# EasyEDA Pro project Board1.eprj

# Schematic Schematic1
Create Date: 2023-07-02; Page Name: P1; Project Name: STM32F407; Schematic Name: Schematic1; Update Date: 2023-07-29; Company: 嘉立创EDA; Page Size: A4; Version: V1.0
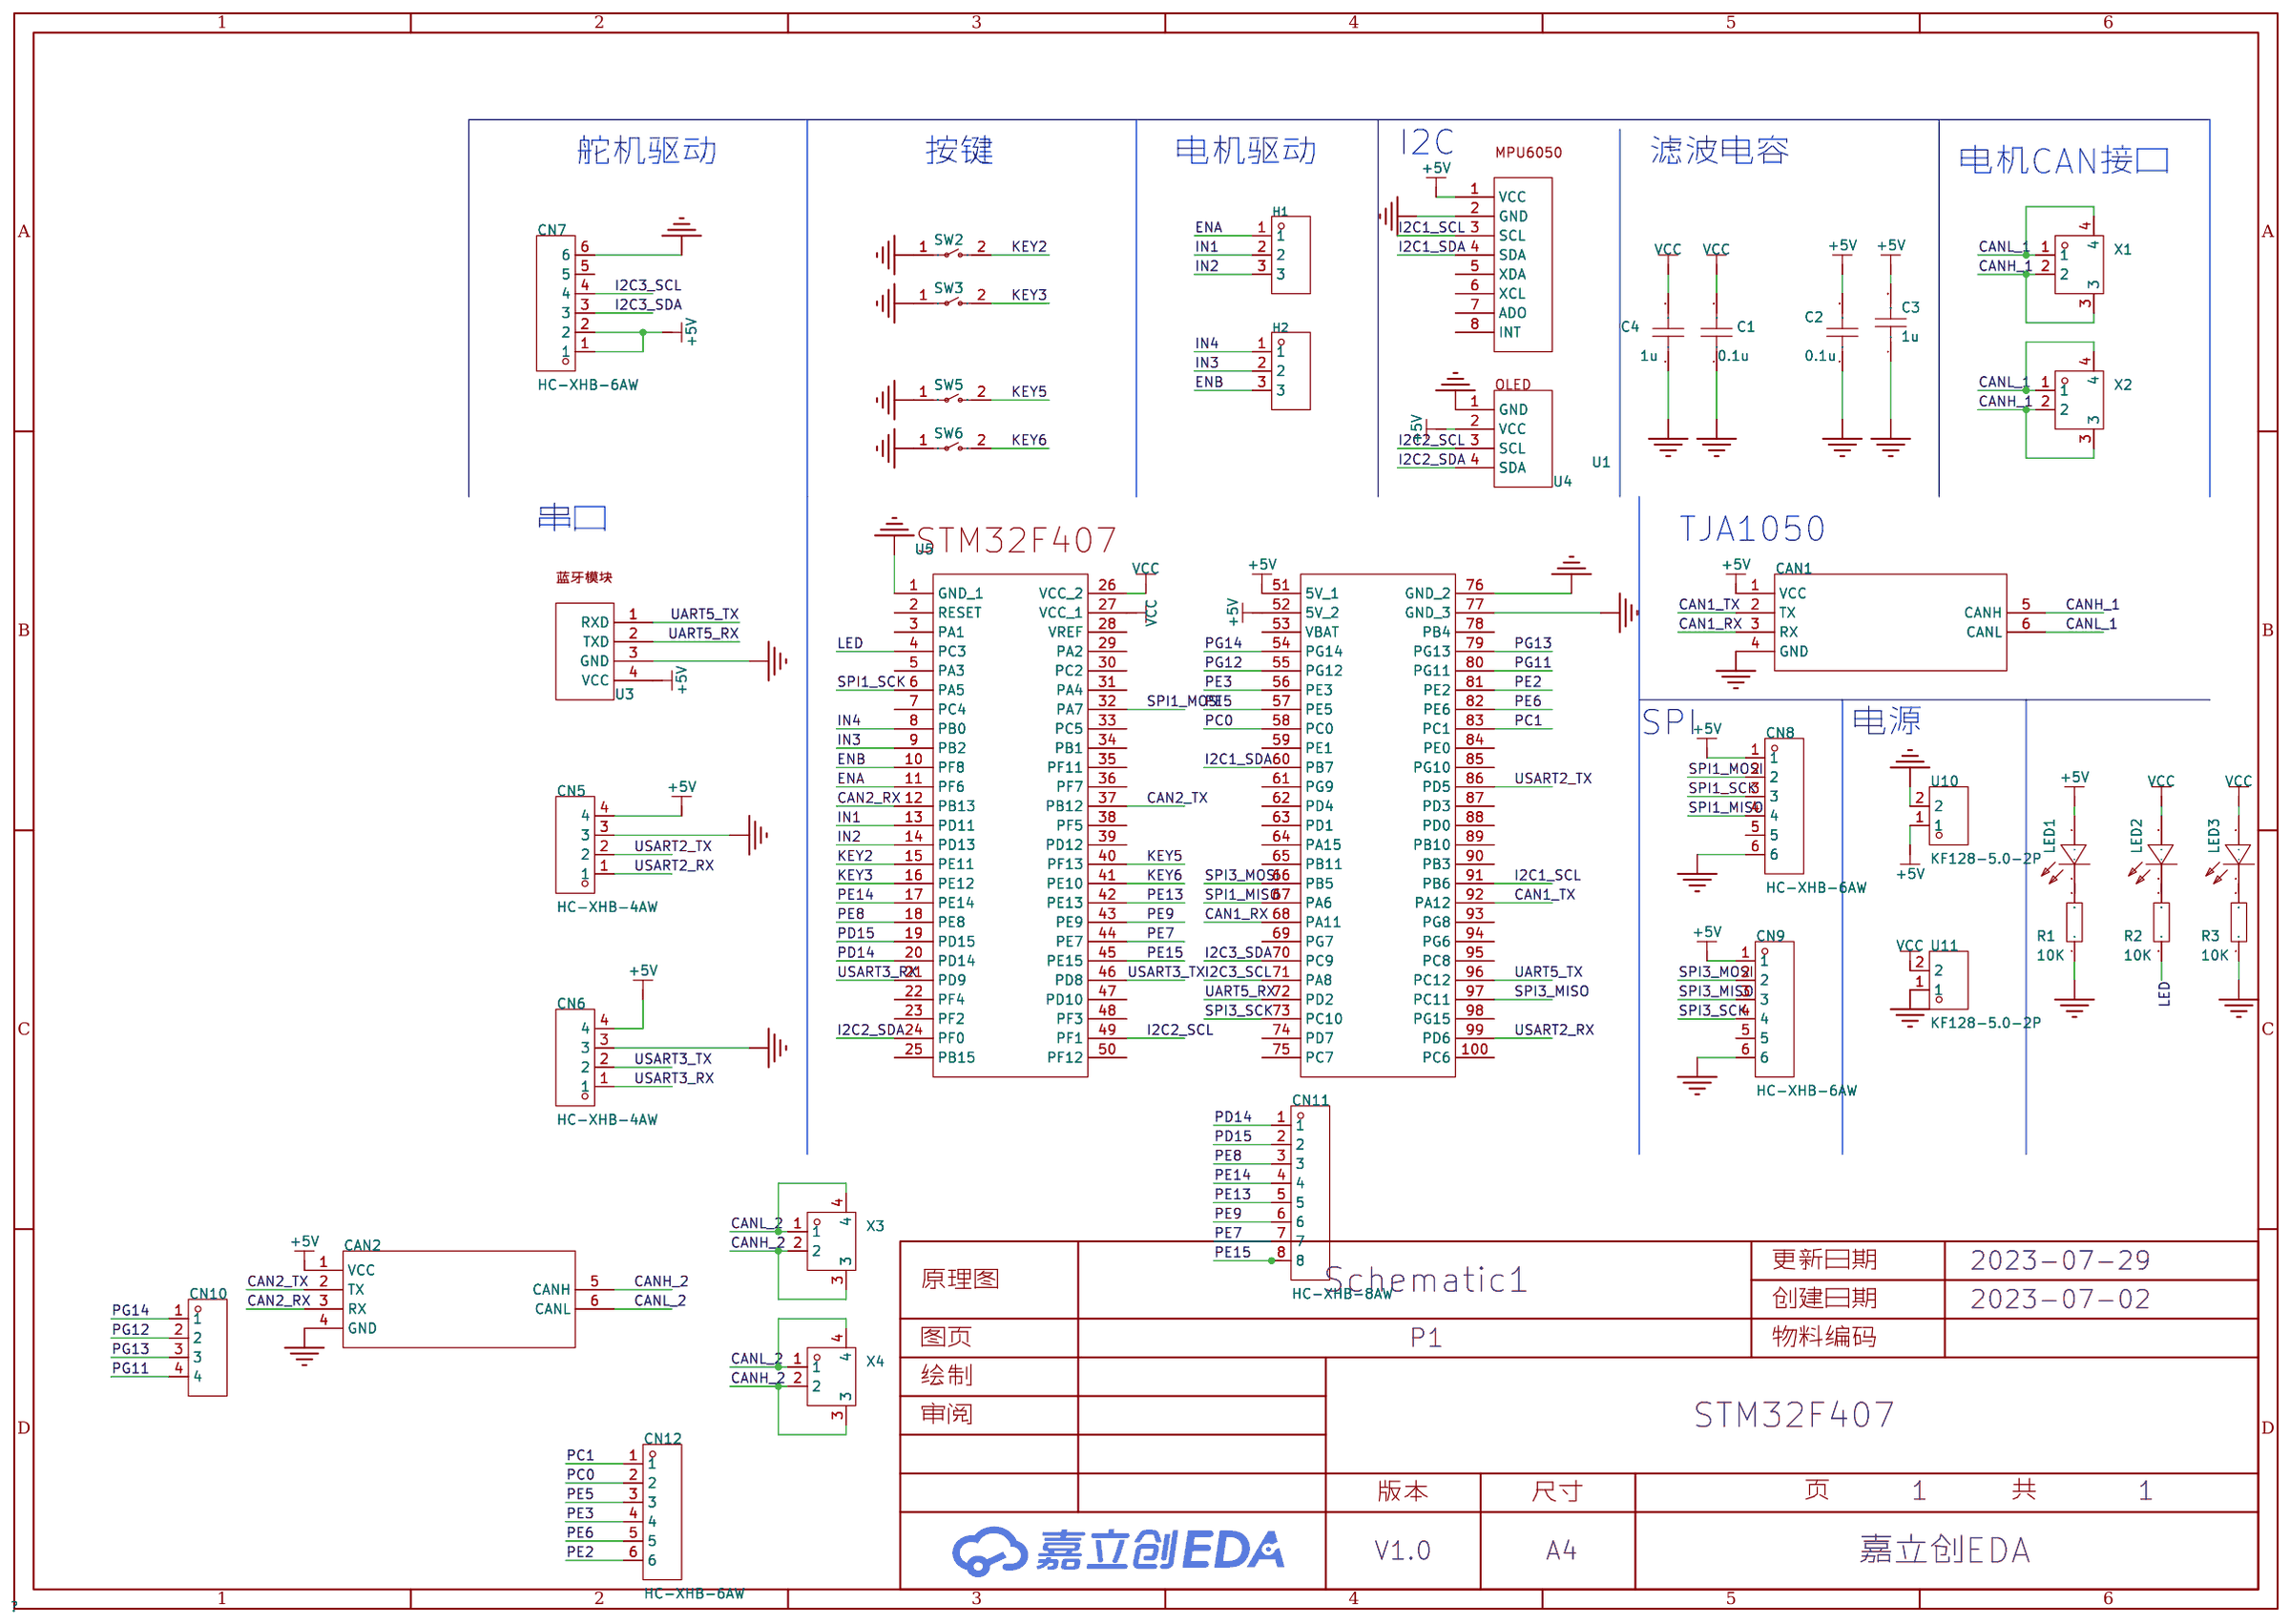
[diagram p0: schematic sheet]

## Parts
C1  0.1u  [C0603]
C2  0.1u  [C0603]
C3  1u  [C0603]
C4  1u  [C0603]
CAN1  -  [CAN模块]
CAN2  -  [CAN模块]
CN5  HC-XHB-4AW  [CONN-TH_4P-P2.5_HCTL_HC-XHB-4AW]
CN6  HC-XHB-4AW  [CONN-TH_4P-P2.5_HCTL_HC-XHB-4AW]
CN7  HC-XHB-6AW  [CONN-TH_6P-P2.50_HCTL_HC-XHB-6AW]
CN8  HC-XHB-6AW  [CONN-TH_6P-P2.50_HCTL_HC-XHB-6AW]
CN9  HC-XHB-6AW  [CONN-TH_6P-P2.50_HCTL_HC-XHB-6AW]
CN10  HC-XHB-4AW  [CONN-TH_4P-P2.5_HCTL_HC-XHB-4AW]
CN11  HC-XHB-8AW  [CONN-TH_HC-XHB-8AW]
CN12  HC-XHB-6AW  [CONN-TH_6P-P2.50_HCTL_HC-XHB-6AW]
H1  -  [HDR-TH_3P-P2.54-V-F]
H2  -  [HDR-TH_3P-P2.54-V-F]
LED1  NCD0805R1  [LED0805-RD_RED]
LED2  NCD0805R1  [LED0805-RD_RED]
LED3  NCD0805R1  [LED0805-RD_RED]
R1  10K  [R0603]
R2  10K  [R0603]
R3  10K  [R0603]
SW2  TS-1007S-AR02516  [SW-SMD_L6.1-W3.6-LS7.9]
SW3  TS-1007S-AR02516  [SW-SMD_L6.1-W3.6-LS7.9]
SW5  TS-1007S-AR02516  [SW-SMD_L6.1-W3.6-LS7.9]
SW6  TS-1007S-AR02516  [SW-SMD_L6.1-W3.6-LS7.9]
U1  -  [MPU6050]
U3  -  [蓝牙模块]
U4  -  [OLED]
U5  -  [CORE BORED]  (section 1)
U10  KF128-5.0-2P  [CONN-TH_P5.00_KF128-5.0-2P]
U11  KF128-5.0-2P  [CONN-TH_P5.00_KF128-5.0-2P]
X1  GH125-S02DCA-00  [CONN-SMD_2P-P1.25_JUSHUO_GH125-S02DCA-00]
X2  GH125-S02DCA-00  [CONN-SMD_2P-P1.25_JUSHUO_GH125-S02DCA-00]
X3  GH125-S02DCA-00  [CONN-SMD_2P-P1.25_JUSHUO_GH125-S02DCA-00]
X4  GH125-S02DCA-00  [CONN-SMD_2P-P1.25_JUSHUO_GH125-S02DCA-00]

## Library data of the parts
C1-C4 = CAP_0603: Supplier Footprint: 0603
CAN1 CAN2 = CAN模块
CN5 CN6 CN10 = HC-XHB-4AW: 参考系列:-;间距:2.5mm;插针结构:1x4P;排数:1;每排PIN数:4;行距:-;公母:公型插针;安装方式:弯插;额定电流:3A;工作温度范围:-25℃~+85℃;; LCSC Part Name: 2.54带锁扣卧式插件 4P 针座连接器线对板/线对线连接器; Supplier Part: C2845507; Manufacturer: HCTL(华灿天禄); Supplier Footprint: 弯插,P=2.5mm; JLCPCB Part Class: Extended Part; Datasheet: https://atta.szlcsc.com/upload/public/pdf/source/20210729/C2845505_EFBF7AEAA36C6A5A1E79F7933436620E.pdf; Supplier: LCSC; Pitch: 2.5mm; Pins Structure: 1x4P; Number of Rows: 1; Number of PINs Per Row: 4; Gender: 公型插针; Mounting Style: 弯插; Current Rating (Max): 3A; Operating Temperature Range: -25℃~+85℃
CN7-CN9 CN12 = HC-XHB-6AW: 参考系列:-;间距:2.5mm;插针结构:1x6P;排数:1;每排PIN数:6;行距:-;公母:公型插针;安装方式:弯插;额定电流:3A;工作温度范围:-25℃~+85℃;; LCSC Part Name: 2.54带锁扣卧式插件 6P 针座连接器线对板/线对线连接器; Supplier Part: C2845509; Manufacturer: HCTL(华灿天禄); Supplier Footprint: 弯插,P=2.5mm; JLCPCB Part Class: Extended Part; Datasheet: https://atta.szlcsc.com/upload/public/pdf/source/20210729/C2845505_EFBF7AEAA36C6A5A1E79F7933436620E.pdf; Supplier: LCSC; Pitch: 2.5mm; Pins Structure: 1x6P; Number of Rows: 1; Number of PINs Per Row: 6; Gender: 公型插针; Mounting Style: 弯插; Current Rating (Max): 3A; Operating Temperature Range: -25℃~+85℃
CN11 = HC-XHB-8AW: 参考系列:-;间距:2.5mm;插针结构:1x8P;排数:1;每排PIN数:8;行距:-;公母:公型插针;安装方式:弯插;额定电流:3A;工作温度范围:-25℃~+85℃;; LCSC Part Name: 2.54带锁扣卧式插件 8P 针座连接器线对板/线对线连接器; Supplier Part: C2845511; Manufacturer: HCTL(华灿天禄); Supplier Footprint: 弯插,P=2.5mm; JLCPCB Part Class: Extended Part; Datasheet: https://atta.szlcsc.com/upload/public/pdf/source/20210729/C2845505_EFBF7AEAA36C6A5A1E79F7933436620E.pdf; Supplier: LCSC; Pitch: 2.5mm; Pins Structure: 1x8P; Number of Rows: 1; Number of PINs Per Row: 8; Gender: 公型插针; Mounting Style: 弯插; Current Rating (Max): 3A; Operating Temperature Range: -25℃~+85℃
H1 H2 = HDR-F_2.54_1x3P: Supplier Part: C541850; Supplier Footprint: 插件
LED1-LED3 = NCD0805R1: 发光颜色:红灯;; LCSC Part Name: 红灯; Supplier Part: C84256; Manufacturer: 国星光电; Supplier Footprint: 0805; JLCPCB Part Class: Basic Part; Datasheet: https://atta.szlcsc.com/upload/public/pdf/source/20200820/C84256_F0A75A43B3EAD75808600A0514C76B99.pdf; Supplier: LCSC; Emitted Color: 红灯
R1-R3 = Res_0603: Supplier Footprint: 0603
SW2 SW3 SW5 SW6 = TS-1007S-AR02516: 触点电流:50mA;额定电压(DC):12V;绝缘电阻:100MΩ;电路结构:单刀单掷;安装方式:立贴;作用力:160gf@±50gf;机械寿命:5万次;带支架:否;; LCSC Part Name: 6.1*3.7*2.5mm 立贴 轻触开关; Supplier Part: C720381; Manufacturer: XUNPU(讯普); Supplier Footprint: SMD; JLCPCB Part Class: Extended Part; Datasheet: https://atta.szlcsc.com/upload/public/pdf/source/20200812/C720381_7D5C1A68D18F0196EF37FF8AC1146778.pdf; Supplier: LCSC; Contact Current: 50mA; Voltage Rating (DC): 12V; Insulation Resistance: 100MΩ; Circuit: 单刀单掷; Mounting Style: 立贴; Actuator Style: 矩形按钮; Actuator/Cap Color: 灰色; Operating Force: 160gf@±50gf; Mechanical Life: 5万次; Operating Temperature: -30℃~+80℃; Pin Style: 鸥翼型; Switch Length: 6.1mm; Switch Width: 3.7mm; Switch Height: 2.5mm; Strike Gundam: 否
U1 = MPU6050
U3 = 蓝牙模块
U4 = OLED
U5 = CORE BORED
U10 U11 = KF128-5.0-2P: 间距:5mm;排数:1;每排PIN数:2;安装方式:直针;额定电流:24A;额定电压:250V;线规 - AWG:12~22;线规 - mm?:2.5;工作温度范围:-40℃~+105℃;颜色:绿色;; LCSC Part Name: 5mm 排数:1 每排P数:2 直针 可拼接 铜 环保; Supplier Part: C474950; Manufacturer: KEFA(科发); Supplier Footprint: 直插,P=5mm; JLCPCB Part Class: Extended Part; Datasheet: https://atta.szlcsc.com/upload/public/pdf/source/20200115/C474950_DBD958BD409DEFD076718528A2A5023E.pdf; Supplier: LCSC; Pitch: 5mm; Number of Rows: 1; Number of PINs Per Row: 2; Mounting Style: 直针; Current Rating (Max): 24A; Voltage Rating (Max): 250V; Wire Gauge - AWG: 12~22; Wire Gauge - mm?: 2.5; Operating Temperature Range: -40℃~+105℃; Color: 绿色
X1-X4 = GH125-S02DCA-00: 参考系列:-;间距:1.25mm;插针结构:1x2P;排数:1;每排PIN数:2;行距:-;公母:公型插针;安装方式:卧贴;额定电流:1A;工作温度范围:-25℃~+85℃;; LCSC Part Name: GH1.25卧式贴片 带扣; Supplier Part: C2886765; Manufacturer: JS(钜硕电子); Supplier Footprint: SMD,P=1.25mm; JLCPCB Part Class: Extended Part; Datasheet: https://atta.szlcsc.com/upload/public/pdf/source/20210818/CD11791E5ED3EDF45A7009E9C8A2BD4C.pdf; Supplier: LCSC; Pitch: 1.25mm; Pins Structure: 1x2P; Number of Rows: 1; Number of PINs Per Row: 2; Gender: 公型插针; Mounting Style: 卧贴; Current Rating (Max): 1A; Operating Temperature Range: -25℃~+85℃

## Nets
+5V: C2.2 C3.2 CAN1.1(VCC) CAN2.1(VCC) CN5.4 CN6.4 CN7.1 CN7.2 CN8.1 CN9.1 LED1.2(+) U1.1(VCC) U3.4(VCC) U4.2(VCC) U5.51(5V_1) U5.52(5V_2) U10.1
GND: C1.1 C2.1 C3.1 C4.1 CAN1.4(GND) CAN2.4(GND) CN5.3 CN6.3 CN7.6 CN8.6 CN9.6 R1.1 R3.1 SW2.1 SW3.1 SW5.1 SW6.1 U1.2(GND) U3.3(GND) U4.1(GND) U5.1(GND) U5.76(GND_2) U5.77(GND_3) U10.2 U11.1
VCC: C1.2 C4.2 LED2.2(+) LED3.2(+) U5.26(VCC_2) U5.27(VCC_1) U11.2
CAN1_RX: CAN1.3(RX) U5.68(PA11)
CAN1_TX: CAN1.2(TX) U5.92(PA12)
CAN2_RX: CAN2.3(RX) U5.12(PB13)
CAN2_TX: CAN2.2(TX) U5.37(PB12)
CANH_1: CAN1.5(CANH) X1.2 X1.3 X2.2 X2.3
CANH_2: CAN2.5(CANH) X3.2 X3.3 X4.2 X4.3
CANL_1: CAN1.6(CANL) X1.1 X1.4 X2.1 X2.4
CANL_2: CAN2.6(CANL) X3.1 X3.4 X4.1 X4.4
ENA: H1.1 U5.11(PF6)
ENB: H2.3 U5.10(PF8)
I2C1_SCL: U1.3(SCL) U5.91(PB6)
I2C1_SDA: U1.4(SDA) U5.60(PB7)
I2C2_SCL: U4.3(SCL) U5.49(PF1)
I2C2_SDA: U4.4(SDA) U5.24(PF0)
I2C3_SCL: CN7.4 U5.71(PA8)
I2C3_SDA: CN7.3 U5.70(PC9)
IN1: H1.2 U5.13(PD11)
IN2: H1.3 U5.14(PD13)
IN3: H2.2 U5.9(PB2)
IN4: H2.1 U5.8(PB0)
KEY2: SW2.2 U5.15(PE11)
KEY3: SW3.2 U5.16(PE12)
KEY5: SW5.2 U5.40(PF13)
KEY6: SW6.2 U5.41(PE10)
LED: R2.1 U5.4(PC3)
PC0: CN12.2 U5.58(PC0)
PC1: CN12.1 U5.83(PC1)
PD14: CN11.1 U5.20(PD14)
PD15: CN11.2 U5.19(PD15)
PE2: CN12.6 U5.81(PE2)
PE3: CN12.4 U5.56(PE3)
PE5: CN12.3 U5.57(PE5)
PE6: CN12.5 U5.82(PE6)
PE7: CN11.7 U5.44(PE7)
PE8: CN11.3 U5.18(PE8)
PE9: CN11.6 U5.43(PE9)
PE13: CN11.5 U5.42(PE13)
PE14: CN11.4 U5.17(PE14)
PE15: CN11.8 U5.45(PE15)
PG11: CN10.4 U5.80(PG11)
PG12: CN10.2 U5.55(PG12)
PG13: CN10.3 U5.79(PG13)
PG14: CN10.1 U5.54(PG14)
SPI1_MISO: CN8.4 U5.67(PA6)
SPI1_MOSI: CN8.2 U5.32(PA7)
SPI1_SCK: CN8.3 U5.6(PA5)
SPI3_MISO: CN9.3 U5.97(PC11)
SPI3_MOSI: CN9.2 U5.66(PB5)
SPI3_SCK: CN9.4 U5.73(PC10)
UART5_RX: U3.2(TXD) U5.72(PD2)
UART5_TX: U3.1(RXD) U5.96(PC12)
USART2_RX: CN5.1 U5.99(PD6)
USART2_TX: CN5.2 U5.86(PD5)
USART3_RX: CN6.1 U5.21(PD9)
USART3_TX: CN6.2 U5.46(PD8)
$1N11723: LED1.1(-) R1.2
$1N11798: LED2.1(-) R2.2
$1N25769: LED3.1(-) R3.2

Not connected (* = marked no-connect by the designer): CN7 5; CN8 5; CN9 5; U1 5(XDA) 6(XCL) 7(ADO) 8(INT); U5 2(RESET) 3(PA1) 5(PA3) 7(PC4) 22(PF4) 23(PF2) 25(PB15) 28(VREF) 29(PA2) 30(PC2) 31(PA4) 33(PC5) 34(PB1) 35(PF11) 36(PF7) 38(PF5) 39(PD12) 47(PD10) 48(PF3) 50(PF12) 53(VBAT) 59(PE1) 61(PG9) 62(PD4) 63(PD1) 64(PA15) 65(PB11) 69(PG7) 74(PD7) 75(PC7) 78(PB4) 84(PE0) 85(PG10) 87(PD3) 88(PD0) 89(PB10) 90(PB3) 93(PG8) 94(PG6) 95(PC8) 98(PG15) 100(PC6)

## Notes on the sheet
- I2C
- 舵机驱动
- 按键
- 电机驱动
- 滤波电容
- 电机CAN接口
- 串口
- TJA1050
- SPI
- 电源

# Board PCB3
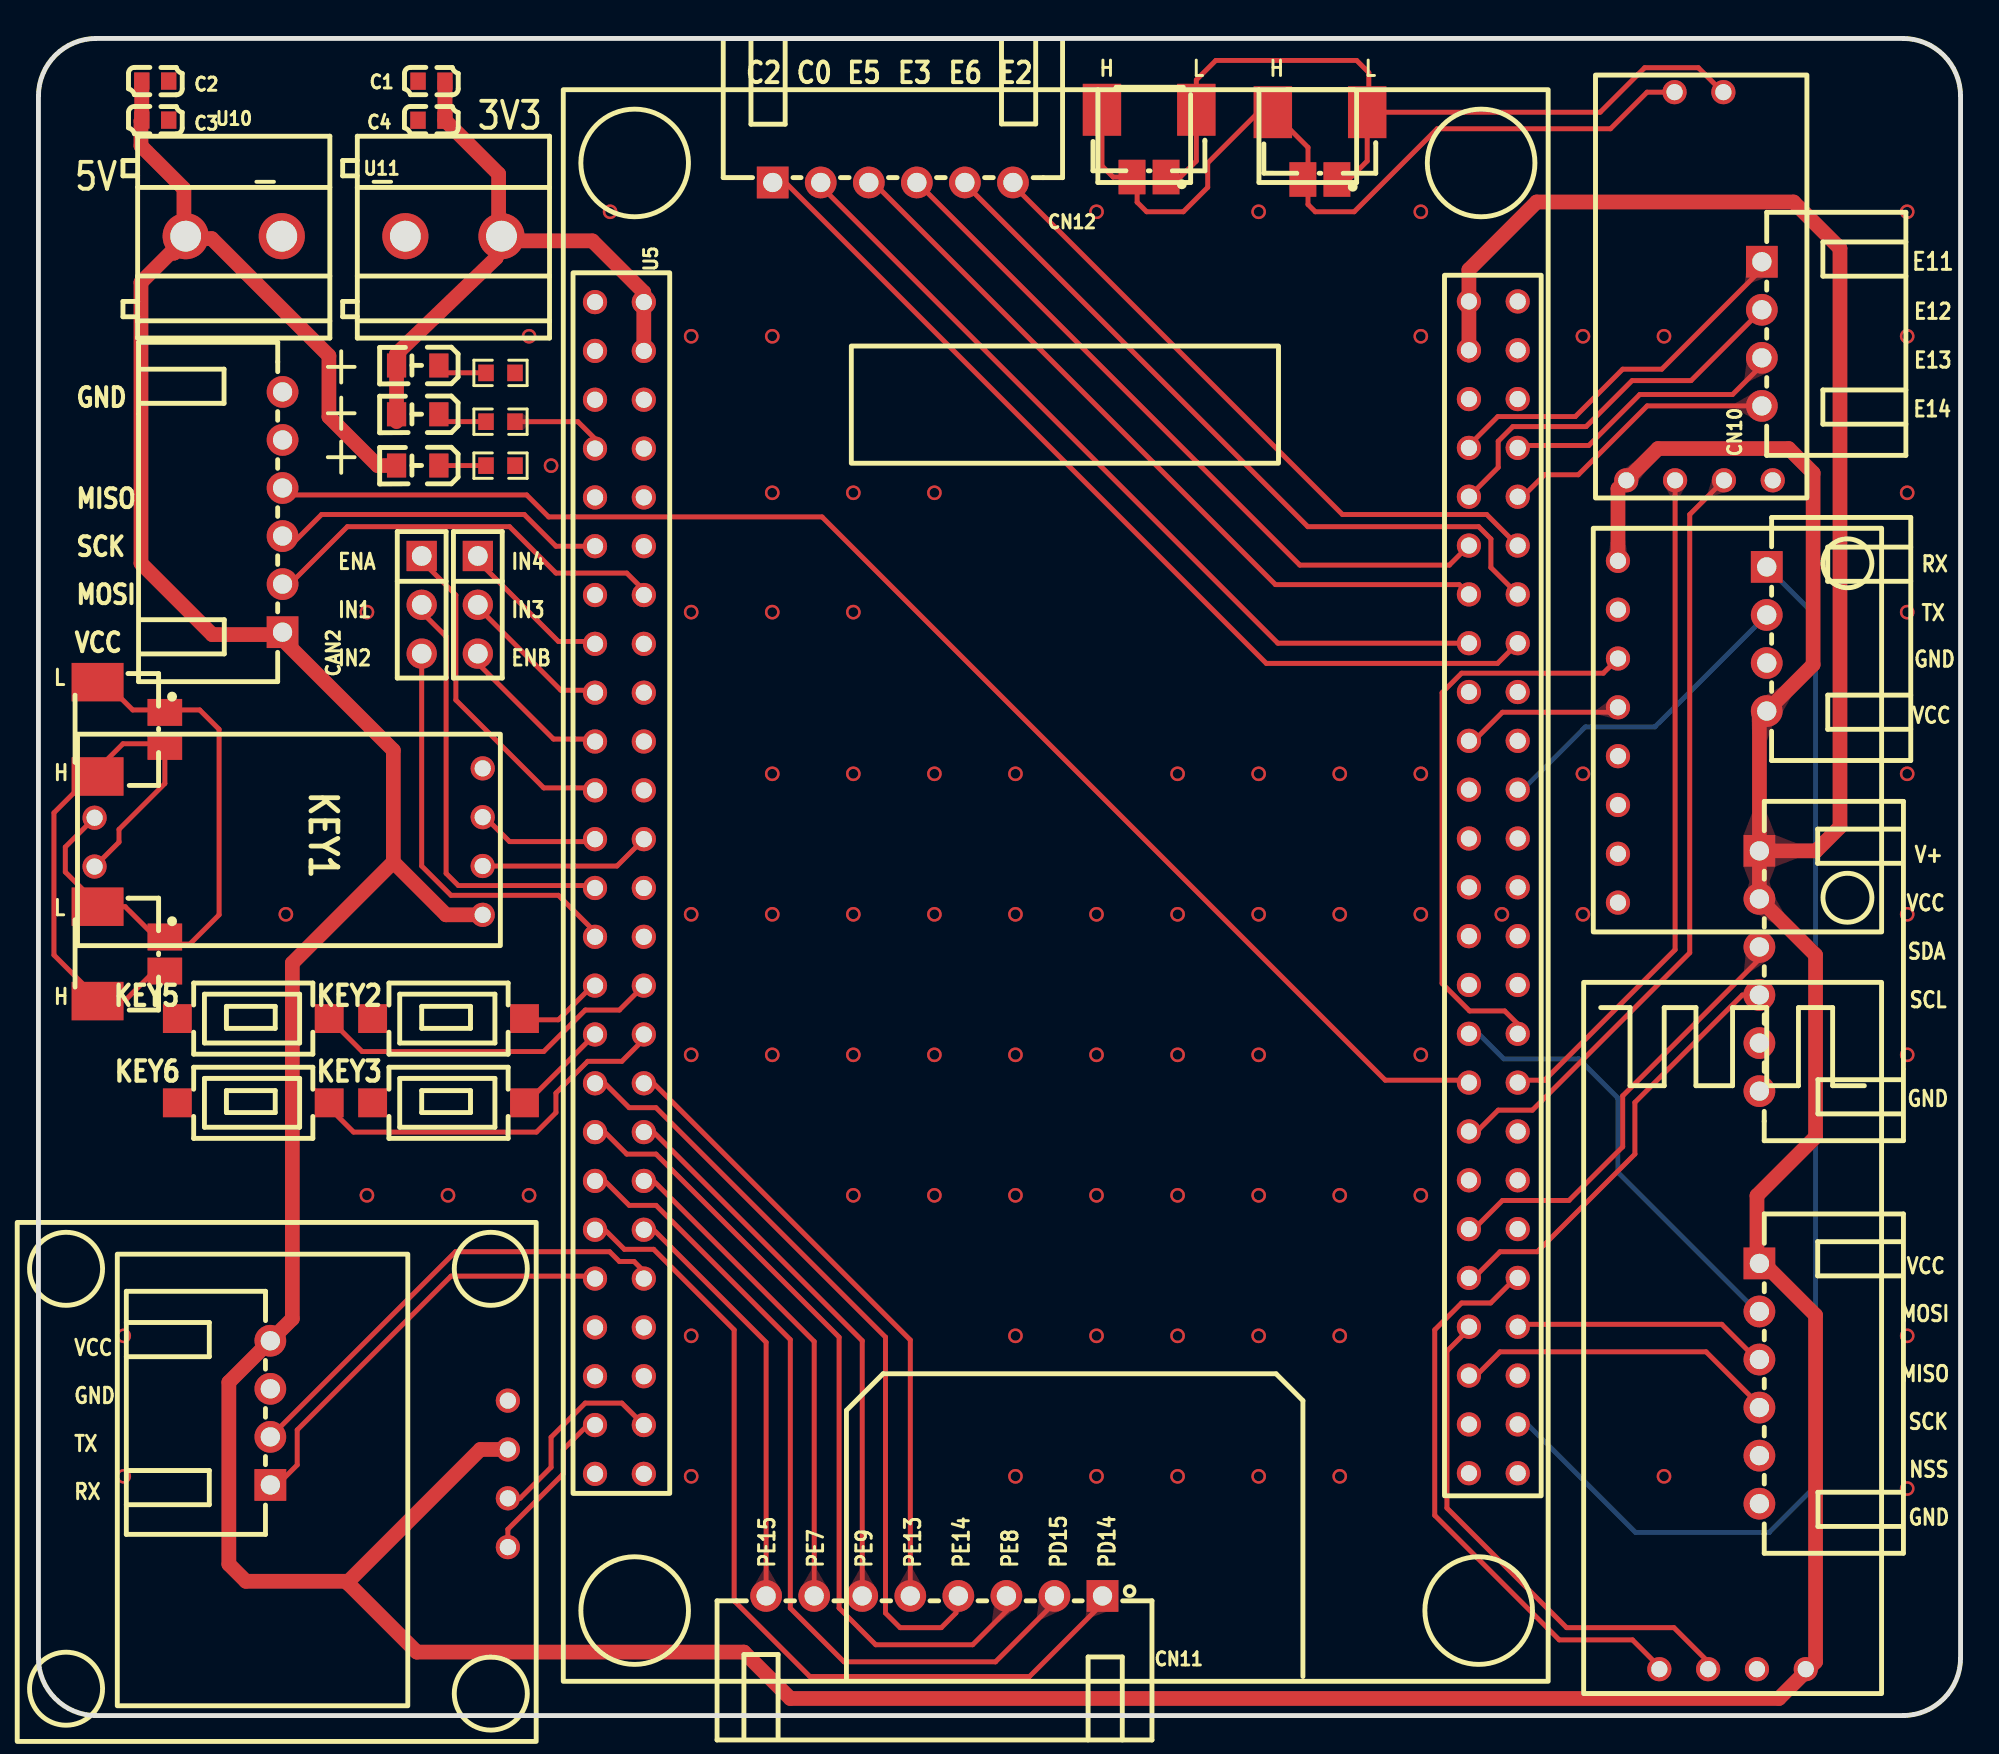
[diagram p1: board, top side]
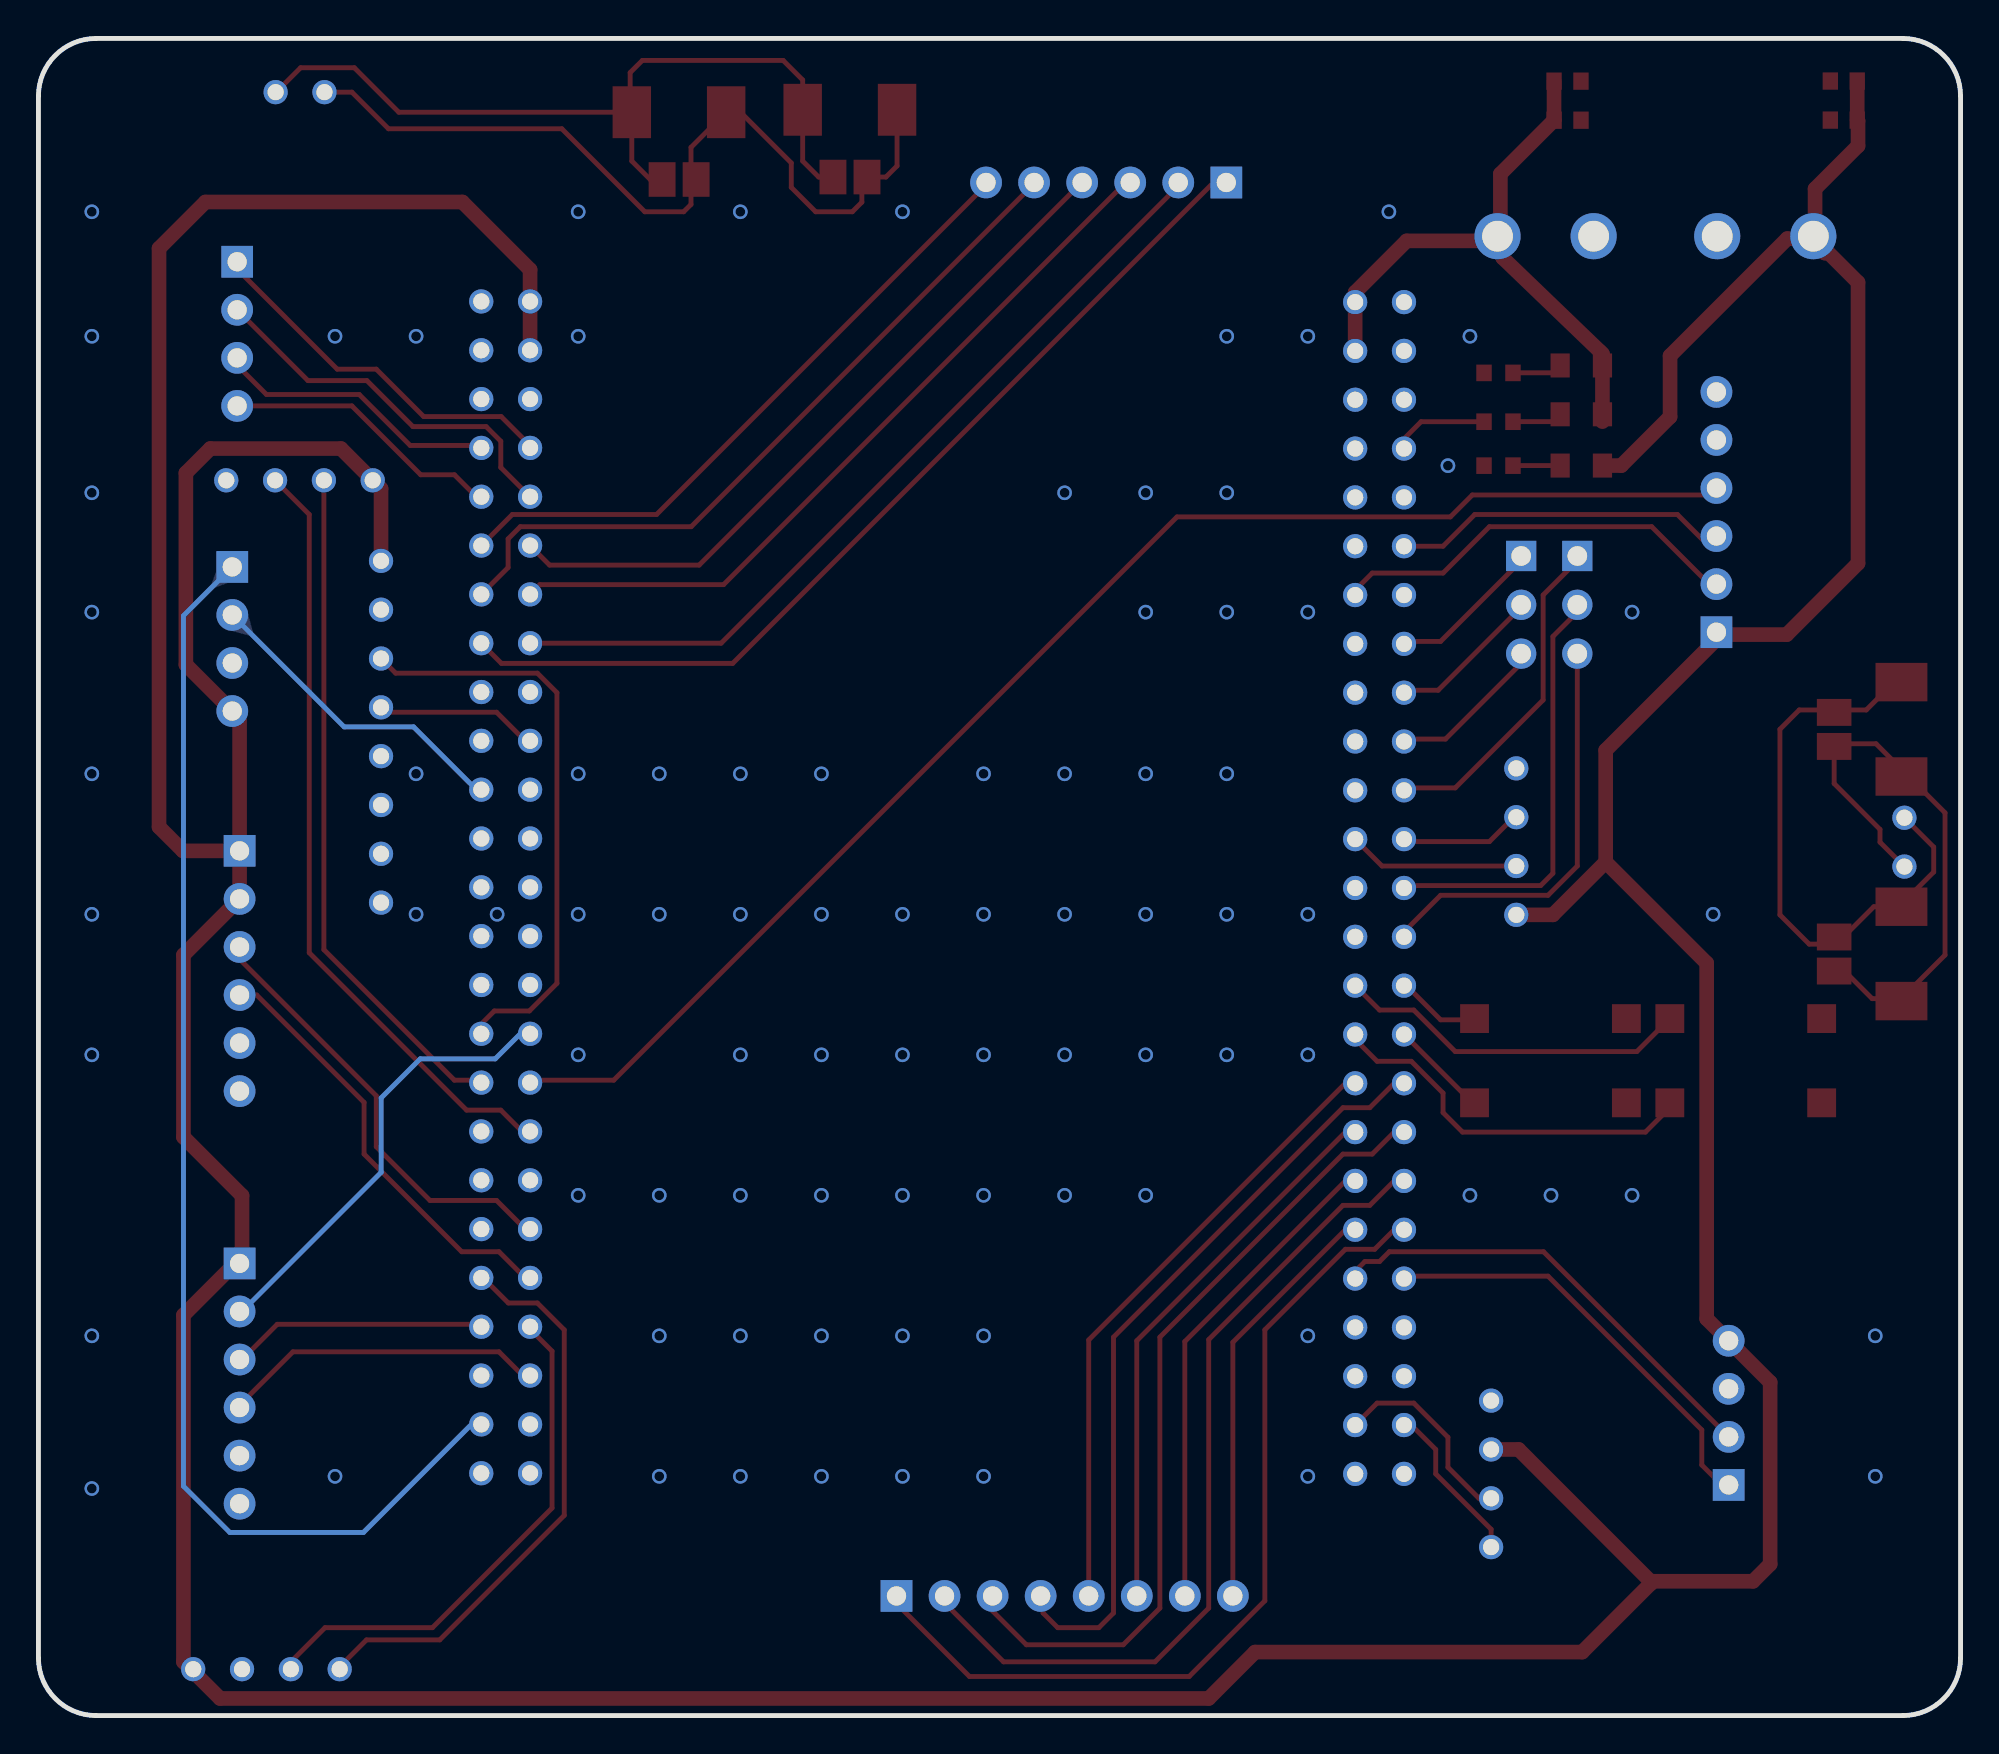
[diagram p2: board, bottom side, seen from below]

Outline 100 x 87.25 mm; copper layers: Top Layer, Bottom Layer. Coordinates in mm from the lower left corner of the outline.
Outline path: 0,84.25 0,3 arc(0.88,0.88) 3,0 97,0 arc(99.12,0.88) 100,3 100,84.25 arc(99.12,86.37) 97,87.25 3,87.25 arc(0.88,86.37) 0,84.25
Stack: Top Layer 0.035mm / Dielectric1 1.51mm FR4 er 4.5 / Bottom Layer 0.035mm

## Design rules (mm)
template: JLCPCB Capability(Two Layers Board)
spacing copperThickness1oz (default): track to track 0.102, other pairs 0.152 to 0.3
spacing copperThickness2oz: track to track 0.203, other pairs 0.152 to 0.3
track width copperThickness1oz (default): min 0.127, default 0.254, max 2.54
track width copperThickness2oz: min 0.203, default 0.254, max 2.54
differential pair differentialPair (default): width min 0.127, default 0.254, max 2.54; gap min 0.152, default 0.152
via viaSize (default): diameter min 0.5, default 0.61, max 10; hole min 0.3, default 0.305, max 6.3

## Placement (name value [footprint] x y rotation side)
C1  0.1u  [C0603]  20.45 85.03 0 top
C2  0.1u  [C0603]  6.08 85.03 180 top
C3  1u  [C0603]  6.08 83 180 top
C4  1u  [C0603]  20.45 82.99 0 top
CAN1  -  [CAN模块]  91.63 61.59 180 top
CAN2  -  [CAN模块]  25.78 50.67 270 top
CN5  HC-XHB-4AW  [CONN-TH_4P-P2.5_HCTL_HC-XHB-4AW]  89.92 56.01 90 top
CN6  HC-XHB-4AW  [CONN-TH_4P-P2.5_HCTL_HC-XHB-4AW]  12.06 15.75 270 top
CN7  HC-XHB-6AW  [CONN-TH_6P-P2.50_HCTL_HC-XHB-6AW]  89.54 38.73 90 top
CN8  HC-XHB-6AW  [CONN-TH_6P-P2.50_HCTL_HC-XHB-6AW]  12.7 62.61 270 top
CN9  HC-XHB-6AW  [CONN-TH_6P-P2.50_HCTL_HC-XHB-6AW]  89.54 17.27 90 top
CN10  HC-XHB-4AW  [CONN-TH_4P-P2.5_HCTL_HC-XHB-4AW]  89.66 71.88 90 top
CN11  HC-XHB-8AW  [CONN-TH_HC-XHB-8AW]  46.61 6.22 180 top
CN12  HC-XHB-6AW  [CONN-TH_6P-P2.50_HCTL_HC-XHB-6AW]  44.45 79.76 180 top
H1  -  [HDR-TH_3P-P2.54-V-F]  19.94 57.78 270 top
H2  -  [HDR-TH_3P-P2.54-V-F]  22.86 57.78 270 top
LED1  NCD0805R1  [LED0805-RD_RED]  19.73 65.03 180 top
LED2  NCD0805R1  [LED0805-RD_RED]  19.73 67.7 180 top
LED3  NCD0805R1  [LED0805-RD_RED]  19.73 70.24 180 top
R1  10K  [R0603]  24.04 65.02 180 top
R2  10K  [R0603]  24.04 67.31 180 top
R3  10K  [R0603]  24.04 69.85 180 top
SW2  TS-1007S-AR02516  [SW-SMD_L6.1-W3.6-LS7.9]  21.34 36.26 0 top
SW3  TS-1007S-AR02516  [SW-SMD_L6.1-W3.6-LS7.9]  21.34 31.88 0 top
SW5  TS-1007S-AR02516  [SW-SMD_L6.1-W3.6-LS7.9]  11.18 36.26 0 top
SW6  TS-1007S-AR02516  [SW-SMD_L6.1-W3.6-LS7.9]  11.18 31.88 0 top
U1  -  [MPU6050]  82.56 42.29 90 top
U3  -  [蓝牙模块]  80.14 0.76 0 top
U4  -  [OLED]  24.04 16.38 270 top
U5  -  [CORE BORED]  39.88 72.9 270 top
U10  KF128-5.0-2P  [CONN-TH_P5.00_KF128-5.0-2P]  10.16 76.96 0 top
U11  KF128-5.0-2P  [CONN-TH_P5.00_KF128-5.0-2P]  21.59 76.96 0 top
X1  GH125-S02DCA-00  [CONN-SMD_2P-P1.25_JUSHUO_GH125-S02DCA-00]  57.79 81.79 180 top
X2  GH125-S02DCA-00  [CONN-SMD_2P-P1.25_JUSHUO_GH125-S02DCA-00]  66.67 81.66 180 top
X3  GH125-S02DCA-00  [CONN-SMD_2P-P1.25_JUSHUO_GH125-S02DCA-00]  4.83 51.31 270 top
X4  GH125-S02DCA-00  [CONN-SMD_2P-P1.25_JUSHUO_GH125-S02DCA-00]  4.83 39.62 270 top

## Footprints (pads in the part's own frame, mm; a bottom-side part is the same pattern mirrored in y, then rotated)
C0603
  rect 0.8x0.9 smd: 1(-0.7,0) 2(0.7,0)
CAN模块
  round 1.26 hole 0.84: 1(9.017,-2.667) 2(6.477,-2.667) 3(3.937,-2.667) 4(1.397,-2.667) 5(6.506,-22.86) 6(3.966,-22.86)
CONN-SMD_2P-P1.25_JUSHUO_GH125-S02DCA-00
  rect 1.4x1.8 smd: 1(-0.879,1.75) 2(0.891,1.75)
  rect 2x2.7 smd: 3(2.455,-1.75) 4(-2.455,-1.75)
CONN-TH_4P-P2.5_HCTL_HC-XHB-4AW
  rect 1.65x1.65 hole 1: 1(3.75,0)
  round 1.65 hole 1: 2(1.25,0) 3(-1.25,0) 4(-3.75,0)
CONN-TH_6P-P2.50_HCTL_HC-XHB-6AW
  rect 1.65x1.65 hole 1: 1(6.25,0)
  round 1.65 hole 1: 2(3.75,0) 3(1.25,0) 4(-1.25,0) 5(-3.75,0) 6(-6.25,0)
CONN-TH_HC-XHB-8AW
  rect 1.65x1.65 hole 1: 1(-8.75,0)
  round 1.65 hole 1: 2(-6.25,0) 3(-3.75,0) 4(-1.25,0) 5(1.25,0) 6(3.75,0) 7(6.25,0) 8(8.75,0)
CONN-TH_P5.00_KF128-5.0-2P
  round 2.4 hole 1.6: 1(-2.5,0) 2(2.5,0)
CORE BORED
  round 1.26 hole 0.84: 1(-0.635,-10.922) 2(1.905,-10.922) 3(4.445,-10.922) 4(6.985,-10.922) 5(9.525,-10.922) 6(12.065,-10.922) 7(14.605,-10.922) 8(17.145,-10.922) 9(19.685,-10.922) 10(22.225,-10.922) 11(24.765,-10.922) 12(27.305,-10.922) 13(29.845,-10.922) 14(32.385,-10.922) 15(34.925,-10.922) 16(37.465,-10.922) 17(40.005,-10.922) 18(42.545,-10.922) 19(45.085,-10.922) 20(47.625,-10.922) 21(50.165,-10.922) 22(52.705,-10.922) 23(55.245,-10.922) 24(57.785,-10.922) 25(60.325,-10.922) 26(-0.635,-8.382) 27(1.905,-8.382) 28(4.445,-8.382) 29(6.985,-8.382) 30(9.525,-8.382) 31(12.065,-8.382) 32(14.605,-8.382) 33(17.145,-8.382) 34(19.685,-8.382) 35(22.225,-8.382) 36(24.765,-8.382) 37(27.305,-8.382) 38(29.845,-8.382) 39(32.385,-8.382) 40(34.925,-8.382) 41(37.465,-8.382) 42(40.005,-8.382) 43(42.545,-8.382) 44(45.085,-8.382) 45(47.625,-8.382) 46(50.165,-8.382) 47(52.705,-8.382) 48(55.245,-8.382) 49(57.785,-8.382) 50(60.325,-8.382) 51(-0.669,34.544) 52(1.871,34.544) 53(4.41,34.544) 54(6.95,34.544) 55(9.491,34.544) 56(12.03,34.544) 57(14.57,34.544) 58(17.11,34.544) 59(19.651,34.544) 60(22.191,34.544) 61(24.73,34.544) 62(27.27,34.544) 63(29.811,34.544) 64(32.35,34.544) 65(34.891,34.544) 66(37.431,34.544) 67(39.971,34.544) 68(42.511,34.544) 69(45.05,34.544) 70(47.59,34.544) 71(50.13,34.544) 72(52.67,34.544) 73(55.211,34.544) 74(57.751,34.544) 75(60.291,34.544) 76(-0.669,37.084) 77(1.871,37.084) 78(4.41,37.084) 79(6.95,37.084) 80(9.491,37.084) 81(12.03,37.084) 82(14.57,37.084) 83(17.11,37.084) 84(19.651,37.084) 85(22.191,37.084) 86(24.73,37.084) 87(27.27,37.084) 88(29.811,37.084) 89(32.35,37.084) 90(34.891,37.084) 91(37.431,37.084) 92(39.971,37.084) 93(42.511,37.084) 94(45.05,37.084) 95(47.59,37.084) 96(50.13,37.084) 97(52.67,37.084) 98(55.211,37.084) 99(57.751,37.084) 100(60.291,37.084)
HDR-TH_3P-P2.54-V-F
  rect 1.575x1.575 hole 1.02: 1(-2.54,0)
  round 1.575 hole 1.02: 2(0,0) 3(2.54,0)
LED0805-RD_RED
  rect 1x1.25 smd: 1(-1.1,0) 2(1.1,0)
MPU6050
  round 1.26 hole 0.84: 1(17.78,0.381) 2(15.24,0.381) 3(12.7,0.381) 4(10.16,0.381) 5(7.62,0.381) 6(5.08,0.381) 7(2.54,0.381) 8(0,0.381)
OLED
  round 1.26 hole 0.84: 1(0,0.381) 2(2.54,0.381) 3(5.08,0.381) 4(7.62,0.381)
R0603
  rect 0.806x0.864 smd: 1(-0.753,0) 2(0.753,0)
SW-SMD_L6.1-W3.6-LS7.9
  rect 1.5x1.5 smd: 1(-3.95,0) 2(3.95,0)
蓝牙模块
  round 1.26 hole 0.84: 1(4.191,1.651) 2(6.731,1.651) 3(9.271,1.651) 4(11.811,1.651)

## Nets
As in the schematic.

Pads without a net: CN7 5; CN8 5; CN9 5; U1 5 6 7 8; U5 2 3 5 7 22 23 25 28 29 30 31 33 34 35 36 38 39 47 48 50 53 59 61 62 63 64 65 69 74 75 78 84 85 87 88 89 90 93 94 95 98 100

## Via types
v1: diameter 0.762, hole 0.508, Top Layer to Bottom Layer, 84 vias

## Routing (per net, layer and track width the routed paths; a pad name or vN(x,y) marks a point on that pad's centre or on a via; arc(x,y) is an arc through that point)
+5V: length 354.3
  Top Layer w0.762: CN7.1 92.48,44.98 93.73,46.23 93.73,76.33 91.31,78.74 77.94,78.74 74.42,75.22 U5.51 74.42,70.77 ; CN7.1 89.54,51.88 CN5.4 92.33,54.67 92.33,64.64 91.06,65.91 84.26,65.91 CAN1.1 82.18,63.83 U1.1 ; CN7.1 CN7.2 92.46,39.56 92.46,30.1 89.41,27.05 89.41,23.88 92.46,20.83 92.46,2.79 90.55,0.89 39.12,0.89 36.7,3.3 19.69,3.3 16.13,6.86 ; 7.44,76.83 7.06,76.45 7.06,76.08 6.96,76.18 5.33,74.56 5.33,59.94 9.04,56.23 12.45,56.23 18.46,50.22 18.46,44.4 ; 7.44,76.83 7.57,76.96 7.57,79.43 5.33,81.66 5.33,82.96 C3.2 C2.2 ; 7.44,76.83 9.02,76.83 15.11,70.74 15.11,67.56 17.65,65.03 LED1.2 ; 16.13,6.86 16.13,6.98 22.99,13.84 24.07,13.84 ; 16.13,6.86 16,6.98 10.8,6.98 9.91,7.87 9.91,17.34 CN6.4 13.21,20.64 13.21,39.15 18.46,44.4 ; 18.46,44.4 21.21,41.66 23.24,41.66
GND:
  vias: v1(4.44,19.76) v1(4.44,12.45) v1(12.87,41.68) v1(17.09,57.4) v1(17.09,27.06) v1(21.31,27.06) v1(25.53,71.75) v1(25.53,27.06) v1(26.67,65.02) v1(29.74,78.23) v1(33.96,71.75) v1(33.96,57.4) v1(33.96,41.68) v1(33.96,34.37) v1(33.96,19.76) v1(33.96,12.45) v1(38.18,71.75) v1(38.18,63.61) v1(38.18,57.4) v1(38.18,48.99) v1(38.18,41.68) v1(38.18,34.37) v1(42.4,63.61) v1(42.4,57.4) v1(42.4,48.99) v1(42.4,41.68) v1(42.4,34.37) v1(42.4,27.06) v1(46.61,63.61) v1(46.61,48.99) v1(46.61,41.68) v1(46.61,34.37) v1(46.61,27.06) v1(50.83,48.99) v1(50.83,41.68) v1(50.83,34.37) v1(50.83,27.06) v1(50.83,19.76) v1(50.83,12.45) v1(55.05,78.23) v1(55.05,41.68) v1(55.05,34.37) v1(55.05,27.06) v1(55.05,19.76) v1(55.05,12.45) v1(59.27,48.99) v1(59.27,41.68) v1(59.27,34.37) v1(59.27,27.06) v1(59.27,19.76) v1(59.27,12.45) v1(63.48,78.23) v1(63.48,48.99) v1(63.48,41.68) v1(63.48,34.37) v1(63.48,27.06) v1(63.48,19.76) v1(63.48,12.45) v1(67.7,48.99) v1(67.7,41.68) v1(67.7,27.06) v1(67.7,19.76) v1(67.7,12.45) v1(71.92,78.23) v1(71.92,71.75) v1(71.92,48.99) v1(71.92,41.68) v1(71.92,34.37) v1(71.92,27.06) v1(76.14,41.68) v1(80.35,71.75) v1(80.35,48.99) v1(80.35,41.68) v1(84.57,71.75) v1(84.57,12.45) v1(97.22,78.23) v1(97.22,71.75) v1(97.22,63.61) v1(97.22,57.4) v1(97.22,48.99) v1(97.22,41.68) v1(97.22,34.37) v1(97.22,19.76) v1(97.22,11.81)
VCC: length 32.3
  Top Layer w0.762: 23.94,76.72 28.82,76.72 31.5,74.04 31.5,71.5 ; 23.94,76.72 23.94,80.2 C4.2 21.15,83 C1.2 ; 23.94,76.72 23.81,76.59 23.81,75.83 18.76,70.97 18.63,70.84 18.63,67.31
CAN1_RX: length 40.7
  Top Layer w0.254: CAN1.3 85.91,62.48 85.91,39.68 77.72,31.5 75.95,31.5 74.96,30.51 74.55,30.51 U5.68
CAN1_TX: length 35.5
  Top Layer w0.254: U5.92 77.09,33.05 78.36,33.05 85.15,39.84 CAN1.2
CAN2_RX: length 6.4
  Top Layer w0.254: CAN2.3 23.24,46.74 24.51,45.47 28.83,45.47 U5.12
CAN2_TX: length 9
  Top Layer w0.254: U5.37 30.1,44.2 23.11,44.2
CANH_1: length 43.8
  Top Layer w0.254: CAN1.5 83.69,84.45 81.79,82.55 72.77,82.55 68.45,78.23 66.43,78.23 66.05,78.61 66.05,81.58 X2.3 64.19,83.44 63.5,83.44 60.83,80.77 60.83,79.5 59.56,78.23 57.66,78.23 57.16,78.73 57.16,80.04 55.91,80.04 55.33,80.62 X1.3
CANH_2: length 29.8
  Top Layer w0.254: 6.58,39.13 6.43,39.13 4.6,37.3 3.08,37.3 0.81,39.56 0.81,46.97 4.4,50.56 6.58,50.56 6.58,48.49 4.19,46.1 4.19,45.44 3.05,44.29
CANL_1: length 42.9
  Top Layer w0.254: 58.41,80.04 59.41,80.04 60.24,80.87 X1.4 60.24,85.09 61.26,86.11 68.58,86.11 69.22,85.47 69.22,83.5 X2.4 ; X2.4 69.13,80.87 68.17,79.91 67.3,79.91 ; X2.4 81.25,83.41 83.57,85.72 86.36,85.72 87.63,84.45 CAN1.6
CANL_2: length 31
  Top Layer w0.254: 3.05,46.83 1.4,45.18 1.4,43.88 3.2,42.08 4.51,42.08 6.46,40.13 7.87,40.13 9.4,41.66 9.4,51.31 8.39,52.31 4.91,52.31 3.08,54.14
ENA: length 17.6
  Top Layer w0.254: 29.08,48.26 26.29,48.26 21.72,52.83 21.72,58.29 19.69,60.32
ENB: length 8.4
  Top Layer w0.254: H2.3 22.86,54.74 26.8,50.8 29.08,50.8
I2C1_SCL: length 30.3
  Top Layer w0.254: U5.91 76.96,35.98 76.28,36.66 74.46,36.66 73.02,38.09 73.02,53.21 74.04,54.23 81.41,54.23 U1.3
I2C1_SDA: length 8.5
  Top Layer w0.254: U1.4 81.92,52.2 76.17,52.2 74.68,50.71 U5.60
I2C2_SCL: length 10.5
  Top Layer w0.254: U5.49 30.35,16.26 28.45,16.26 26.67,14.48 26.67,12.91 25.06,11.3 U4.3
I2C2_SDA: length 8.5
  Top Layer w0.254: U4.4 24.42,9.69 27.31,12.57 27.31,13.84 28.58,15.11 U5.24
I2C3_SCL: length 22.8
  Top Layer w0.254: U5.71 74.68,22.77 76.04,24.13 77.98,24.13 83.06,29.21 83.06,31.9 88.65,37.48 CN7.4
I2C3_SDA: length 23.1
  Top Layer w0.254: CN7.3 89.54,39.35 82.42,32.24 82.42,29.59 79.63,26.8 76.17,26.8 74.68,25.31 U5.70
IN1: length 22.6
  Top Layer w0.254: H1.2 20.07,57.66 20.07,57.28 21.21,56.13 21.21,43.81 21.84,43.18 28.83,43.18 U5.13
IN2: length 21.7
  Top Layer w0.254: H1.3 19.94,44.2 21.46,42.67 27.05,42.67 29.08,40.64
IN3: length 8.1
  Top Layer w0.254: 29.08,53.34 27.18,53.34 22.86,57.66 H2.2
IN4: length 8.2
  Top Layer w0.254: H2.1 22.86,60.07 27.05,55.88 29.08,55.88
KEY2: length 4.8
  Top Layer w0.254: 24.97,36.19 27.05,36.19 28.96,38.1
KEY3: length 5.7
  Top Layer w0.254: 29.2,35.69 25.39,31.88 25.03,31.88
KEY5: length 18.5
  Top Layer w0.254: SW5.2 16.84,34.54 26.29,34.54 28.45,36.7 30.23,36.7 U5.40
KEY6: length 20.4
  Top Layer w0.254: 14.87,31.88 16.4,30.35 25.91,30.35 26.92,31.37 26.92,32.38 28.58,34.04 30.35,34.04 31.88,35.56
LED: length 5.1
  Top Layer w0.254: 29.34,66.04 28.07,67.31 R2.1
PC0: length 44
  Top Layer w0.254: U5.58 64.48,55.79 40.39,79.88
PC1: length 49.8
  Top Layer w0.254: 38.1,80.01 38.61,80.01 63.88,54.74 75.91,54.74 U5.83
PD14: length 45.9
  Top Layer w0.254: CN11.1 55.36,5.83 51.56,2.03 40.13,2.03 36.2,5.97 36.2,20.07 32,24.26 30.48,24.26 29.34,25.4
PD15: length 43.8
  Top Layer w0.254: 29.34,27.94 30.73,26.54 32.13,26.54 39.12,19.56 39.12,5.59 41.91,2.79 49.79,2.79 52.86,5.86 CN11.2
PE2: length 34.1
  Top Layer w0.254: U5.81 75.35,62.48 67.84,62.48 50.8,79.52 50.8,79.76
PE3: length 37.6
  Top Layer w0.254: 45.52,79.88 45.59,79.88 65.62,59.85 73.41,59.85 U5.56
PE5: length 40.3
  Top Layer w0.254: U5.57 73.91,58.84 64.35,58.84 43.31,79.88 43.02,79.88
PE6: length 38.4
  Top Layer w0.254: 48.26,79.63 66.04,61.85 74.93,61.85 75.57,61.21 75.57,59.72 U5.82
PE7: length 25.5
  Top Layer w0.254: 40.36,5.97 40.36,19.46 31.88,27.94
PE8: length 41.9
  Top Layer w0.254: 29.34,30.48 30.61,29.21 32.13,29.21 41.66,19.69 41.66,5.59 43.56,3.68 48.6,3.68 50.36,5.44 CN11.3
PE9: length 29.1
  Top Layer w0.254: 31.88,30.48 42.86,19.5 42.86,5.97
PE13: length 32.6
  Top Layer w0.254: 31.88,33.02 45.36,19.54 45.36,5.97
PE14: length 39.8
  Top Layer w0.254: CN11.4 47.73,6.1 47.73,5.33 46.97,4.57 44.83,4.57 44.07,5.33 44.07,19.69 32.13,31.62 30.73,31.62 29.34,33.02
PE15: length 21.9
  Top Layer w0.254: 31.88,25.4 37.86,19.42 37.86,5.97
PG11: length 14.7
  Top Layer w0.254: CN10.4 83.69,68.13 80.11,64.55 78.36,64.55 77.22,63.41 U5.80
PG12: length 20.1
  Top Layer w0.254: CN10.2 85.98,69.45 82.91,69.45 80.52,67.06 76.71,67.06 75.95,66.29 75.95,64.93 U5.55
PG13: length 14.9
  Top Layer w0.254: CN10.3 89.66,70.25 88.14,68.73 83.31,68.73 80.66,66.07 77.09,66.07 U5.79
PG14: length 19.5
  Top Layer w0.254: U5.54 74.42,66.07 75.93,67.58 79.96,67.58 82.42,70.04 84.45,70.04 89.66,75.25 CN10.1
SPI1_MISO: length 74.4
  Top Layer w0.254: 12.7,63.48 12.72,63.5 25.4,63.5 26.54,62.36 40.77,62.36 70.07,33.05 74.3,33.05 U5.67
SPI1_MOSI: length 21.7
  Top Layer w0.254: 12.7,58.48 16.07,61.85 24.51,61.85 26.92,59.44 30.61,59.44 31.62,58.42
SPI1_SCK: length 17.6
  Top Layer w0.254: U5.6 26.92,60.83 25.27,62.48 14.73,62.48 13.23,60.98 12.7,60.98
SPI3_MISO: length 13.4
  Top Layer w0.254: CN9.3 89.15,18.9 89.03,18.9 87.58,20.35 77.09,20.35 U5.97
SPI3_MOSI: length 23.1
  Bottom Layer w0.254: 74.8,35.59 76.23,34.16 80.14,34.16 82.17,32.13 82.17,28.26 89.54,20.89
SPI3_SCK: length 16.9
  Top Layer w0.254: U5.73 74.8,17.69 76.04,18.92 86.76,18.92 89.54,16.15 CN9.4
UART5_RX: length 27
  Top Layer w0.254: 74.55,20.23 73.28,18.96 73.28,10.79 79.5,4.57 85.09,4.57 86.74,2.92 ; 74.55,20.23 74.68,20.35 ; 74.55,20.23 U5.72
UART5_TX: length 29.9
  Top Layer w0.254: 77.34,22.89 76.98,22.89 75.55,21.46 74.04,21.46 72.64,20.07 72.64,10.41 79.12,3.94 82.93,3.94 83.95,2.92
USART2_RX: length 67.4
  Bottom Layer w0.254: CN5.1 92.46,57.22 92.46,11.94 90.04,9.53 83.09,9.53 77.34,15.27
USART2_TX: length 16.3
  Bottom Layer w0.254: CN5.2 84.09,51.43 80.48,51.43 77.34,48.29
USART3_RX: length 22.7
  Top Layer w0.254: CN6.1 12.42,12 13.46,13.04 13.46,14.86 21.46,22.86 29.21,22.86
USART3_TX: length 24.2
  Top Layer w0.254: 31.75,22.86 30.99,23.62 30.23,23.62 29.72,24.13 21.7,24.13 CN6.2
$1N11723: length 2.5
  Top Layer w0.254: R1.2 23.28,65.03 LED1.1
$1N11798: length 2.5
  Top Layer w0.254: 20.83,67.31 23.28,67.31 R2.2
$1N25769: length 2.4
  Top Layer w0.254: 20.83,69.85 23.28,69.85

## Copper pours and planes (outline as drawn; the poured copper is in the pictures)
GND on Top Layer: -8.13,93.85 104.52,93.85 104.52,-8 -8.13,-8
GND on Bottom Layer: -7.49,90.8 103,90.8 103,-3.18 -7.49,-3.18

Small or netless copper shapes (teardrops, artwork), in the pictures only: 30 on Top Layer, 2 on Bottom Layer

## Text on the board
Top Silkscreen Layer: L | H | VCC | GND | TX | RX | ENA | IN1 | IN2 | MOSI | MISO | SCK | NSS | E14 | E12 | E13 | PE15 | PE7 | PE9 | PE13 | PE14 | PE8 | PD15 | PD14 | IN4 | IN3 | ENB | SDA | SCL | V+ | E11 | KEY6 | KEY2 | KEY3 | KEY5 | C2 | C0 | E5 | E3 | E6 | E2 | 5V | - | 3V3 | KEY1 | +
